# EAGLE schematic LX_CX_Matching_Network (EAGLE 8.4.1)
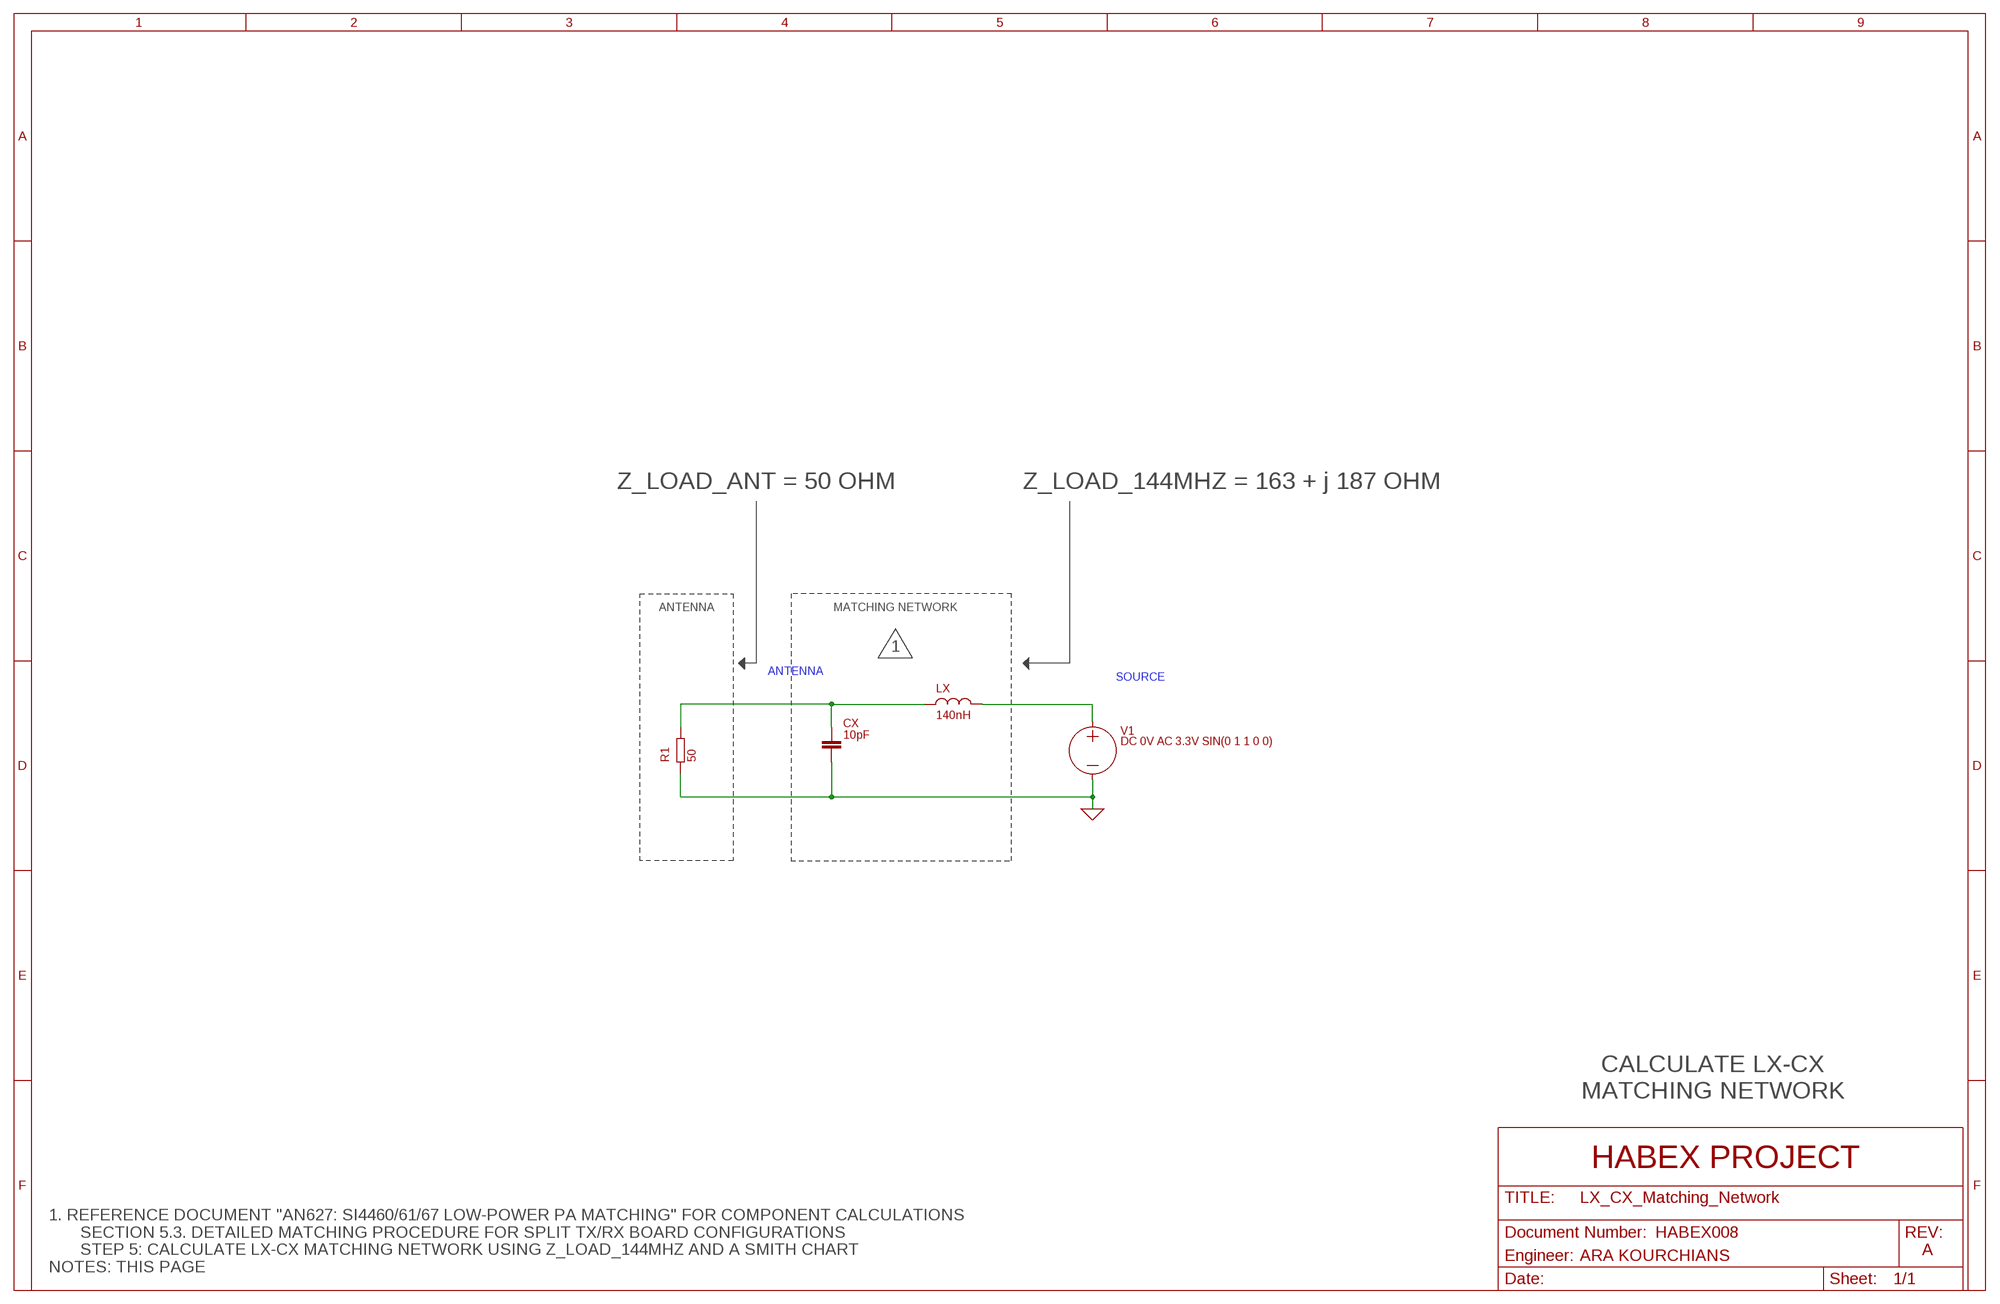
[diagram p0: schematic, sheet 1]

## Parts
CX  10pF  C  (no package)
LX  140nH  L  (no package)
R1  50  R  (no package)
V1  DC 0V AC 3.3V SIN(0 1 1 0 0)  VOLTAGE  (no package)

## Nets
0: CX.2 R1.1 V1.- ; supply symbol labelled GND
ANTENNA: CX.1 LX.1 R1.2
SOURCE: LX.2 V1.+

## Notes on the sheet
- Z_LOAD_ANT = 50 OHM | Z_LOAD_144MHZ = 163 + j 187 OHM
- ANTENNA | MATCHING NETWORK
- 1
- CALCULATE LX-CX
  MATCHING NETWORK
- HABEX PROJECT
- HABEX008
- A
- Engineer: | ARA KOURCHIANS
- 1. REFERENCE DOCUMENT "AN627: SI4460/61/67 LOW-POWER PA MATCHING" FOR COMPONENT CALCULATIONS
         SECTION 5.3. DETAILED MATCHING PROCEDURE FOR SPLIT TX/RX BOARD CONFIGURATIONS
         STEP 5: CALCULATE LX-CX MATCHING NETWORK USING Z_LOAD_144MHZ AND A SMITH CHART
  NOTES: THIS PAGE

## Library data of the parts
CX = ngspice-simulation:C: CAPACITOR
LX = ngspice-simulation:L: INDUCTOR
R1 = ngspice-simulation:R: RESISTOR
V1 = ngspice-simulation:VOLTAGE: Independent Voltage Source, either DC, AC, PULSE, SINE, PWL, EXP, or SFFM; VALUE: 0V